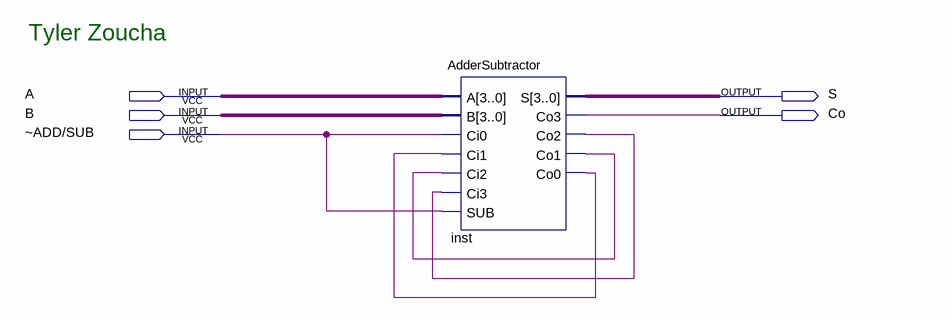
[diagram p0: schematic sheet]
// Quartus schematic Schematic.bdf as structural Verilog: 1 symbols, 5 pins
module Schematic (
  input  A,
  input  B,
  input  \~ADD/SUB ,
  output S,
  output Co
);

  wire inst_co0, inst_co1, inst_co2;
  wire [3:0] inst_s, undriven, undriven_2;

  AdderSubtractor inst (
    .A(undriven), .B(undriven_2), .Ci0(\~ADD/SUB ), .Ci1(inst_co0), .Ci2(inst_co1), .Ci3(inst_co2),
    .SUB(\~ADD/SUB ), .S(inst_s), .Co3(Co), .Co2(inst_co2), .Co1(inst_co1), .Co0(inst_co0));

  // Notes on the sheet:
  //   Tyler Zoucha
endmodule
